# EasyEDA schematic LcsNodes-Building-Block-LCS-Bus-DCC-Signals-4.json
TITLE: LCS Bus - DCC Signal Input; REV: 1.1; Date: 2023-09-17; Sheet: 1/1; Drawn By: helmut-f; Company: Your Company
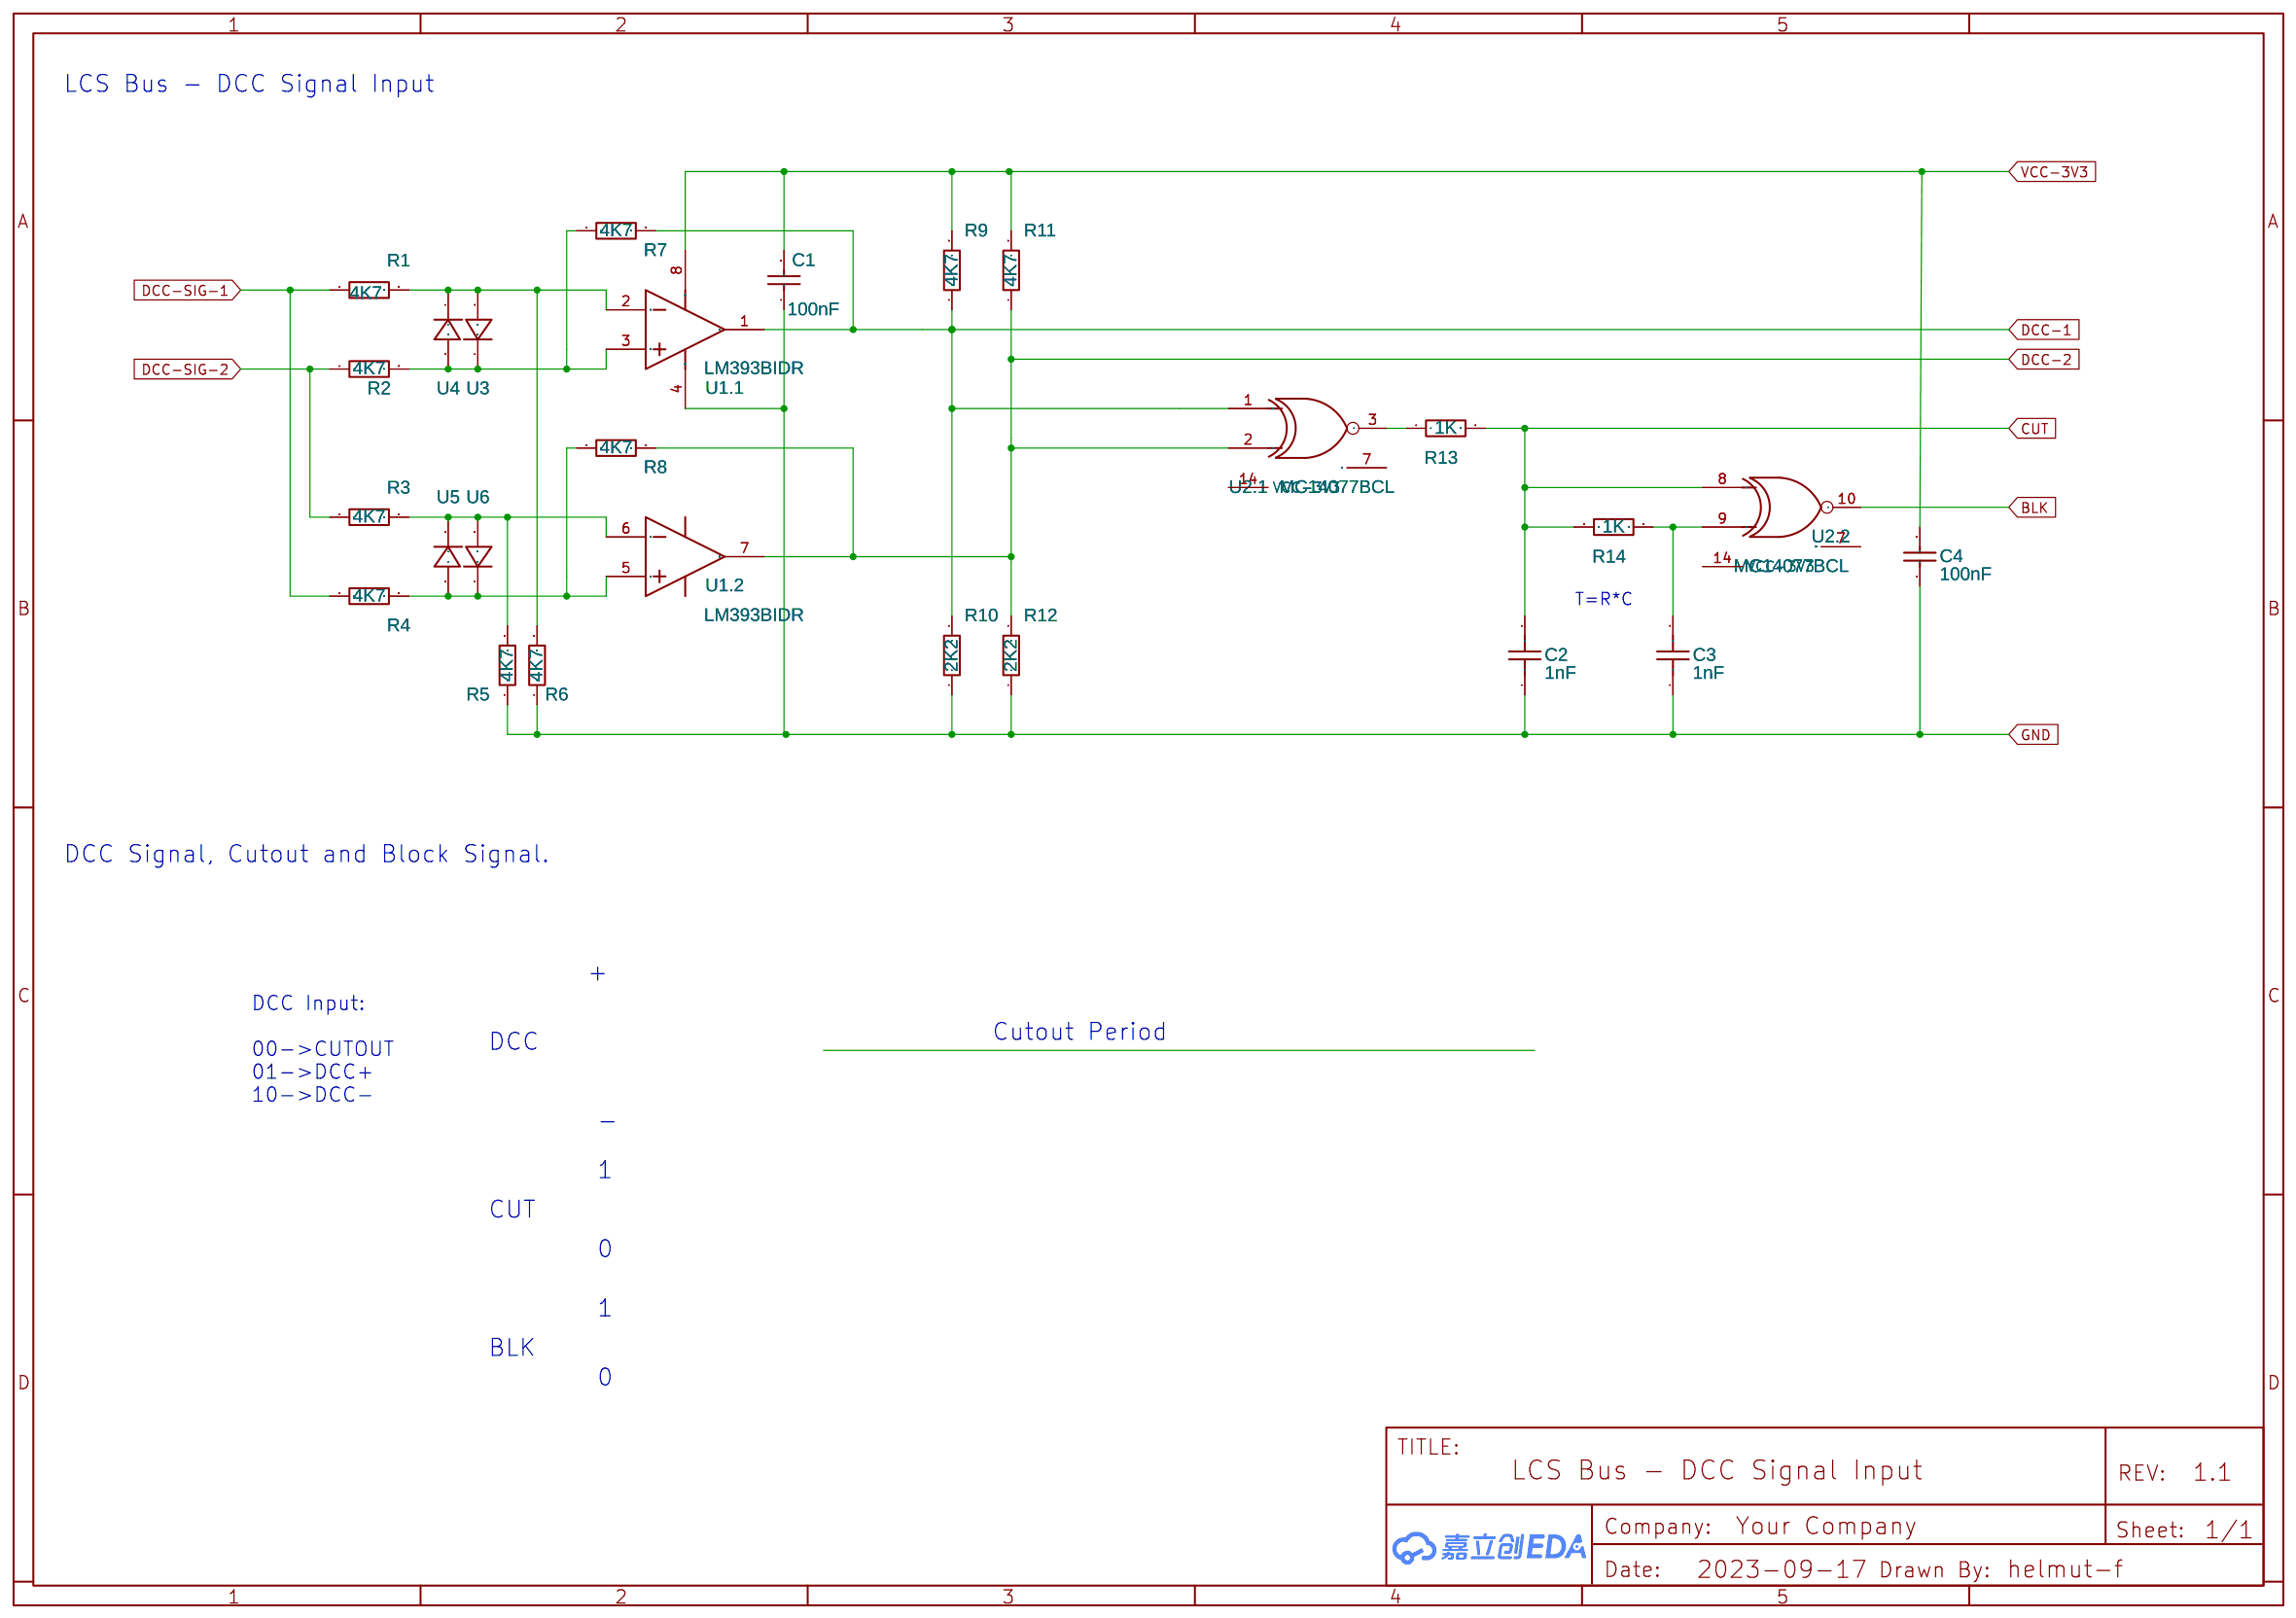
[diagram p0: schematic sheet]

## Parts
C1  100nF  [C1206]
C2  1nF  [C1206]
C3  1nF  [C1206]
C4  100nF  [C1206]
R1  4K7  [R1206]
R2  4K7  [R1206]
R3  4K7  [R1206]
R4  4K7  [R1206]
R5  4K7  [R1206]
R6  4K7  [R1206]
R7  4K7  [R1206]
R8  4K7  [R1206]
R9  4K7  [R1206]
R10  2K2  [R1206]
R11  4K7  [R1206]
R12  2K2  [R1206]
R13  1K  [R1206]
R14  1K  [R1206]
U1  LM393BIDR  [SOIC-8_L4.9-W3.9-P1.27-LS6.0-BL]  (sections 1,2)
U2  MC14077BCL  [SO-14_L8.6-W3.9-P1.27-LS6.0-BL]  (sections 1,2)
U3  1N4148_C9900015438  [LL-34_L3.5-W1.5-RD]
U4  1N4148_C9900015438  [LL-34_L3.5-W1.5-RD]
U5  1N4148_C9900015438  [LL-34_L3.5-W1.5-RD]
U6  1N4148_C9900015438  [LL-34_L3.5-W1.5-RD]

## Library data of the parts
C1 C4 = CC1206KKX7R0BB104: Supplier: LCSC; Manufacturer: YAGEO(国巨); Supplier Part: C107181; JLCPCB Part Class: Extended Part; link: https://lcsc.com/eda_search?q=C107181&%26type=1&ref=editor
C2 C3 = CC1206JRNPO9BN102: Contributor: LCSC; Supplier: LCSC; Supplier Part: C113881; Manufacturer: YAGEO(国巨); JLCPCB Part Class: Extended Part; link: https://lcsc.com/eda_search?q=C113881&%26type=1&ref=editor
R1-R12 = SR1206JR-7W4K7L: Contributor: LCSC; Supplier: LCSC; Supplier Part: C326768; Manufacturer: YAGEO(国巨); JLCPCB Part Class: Extended Part; link: https://lcsc.com/eda_search?q=C326768&%26type=1&ref=editor
R13 R14 = 1206W4F1001T5E: Supplier: LCSC; Manufacturer: UNI-ROYAL(厚声); Supplier Part: C4410; JLCPCB Part Class: Basic Part; link: https://lcsc.com/eda_search?q=C4410&%26type=1&ref=editor
U1 = LM393BIDR: subpart_no: 1; Supplier: LCSC; Supplier Part: C2865059; Manufacturer: TI(德州仪器); JLCPCB Part Class: Extended Part; link: https://lcsc.com/eda_search?q=C2865059&%26type=1&ref=editor
U2 = MC14077BCL: Quad XNOR Gate; subpart_no: 1; Manufacturer Part: MC14077BDR2G; Package Display: No; Supplier: LCSC; Supplier Part: C184249; Manufacturer: onsemi(安森美)
U3-U6 = 1N4148_C9900015438: Contributor: lcsc; Supplier: LCSC; Supplier Part: C9900015438; Manufacturer: null; Manufacturer Part: 1N4148; JLCPCB Part Class: Extended Part; link: https://lcsc.com/eda_search?q=C9900015438&%26type=1&ref=editor

## Nets
GND: C1.1 C2.1 C3.1 C4.1 R5.1 R6.1 R10.1 R12.1 U1.4(GND)
VCC-3V3: C1.2 C4.2 R9.2 R11.2 U1.8(VCC)
BLK: U2.10(Y)
CUT: C2.2 R13.2 R14.1 U2.8(A)
DCC-1: R7.2 R9.1 R10.2 U1.1(1OUT) U2.1(A)
DCC-2: R8.2 R11.1 R12.2 U1.7(2OUT) U2.2(B)
DCC-SIG-1: R1.1 R4.1
DCC-SIG-2: R2.1 R3.1
Net-(C3-2): C3.2 R14.2 U2.9(B)
Net-(R1-2): R1.2 R6.2 U1.2(1IN-) U3.2 U4.1
Net-(R2-2): R2.2 R7.1 U1.3(1IN+) U3.1 U4.2
Net-(R3-2): R3.2 R5.2 U1.6(2IN-) U5.1 U6.2
Net-(R4-2): R4.2 R8.1 U1.5(2IN+) U5.2 U6.1
Net-(R13-1): R13.1 U2.3(Y)

Not connected (* = marked no-connect by the designer): U2 7(GND) 14(VCC-3V3)

## Notes on the sheet
- LCS Bus - DCC Signal Input
- T=R*C
- DCC Signal, Cutout and Block Signal.
- +
- DCC Input:
  00->CUTOUT
  01->DCC+
  10->DCC-
- Cutout Period
- DCC
- -
- 1
- CUT
- 0
- 1
- BLK
- 0
